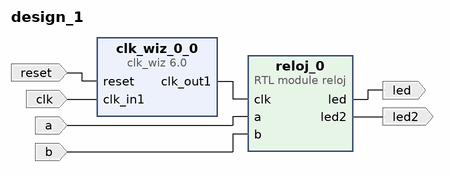
[diagram p0: block diagram of the top level]
# Vivado block design design_1, xc7a35tcpg236-1, Vivado 2018.3
create_bd_design design_1

create_bd_port -dir I -type rst reset
set_property -dict {CONFIG.POLARITY ACTIVE_HIGH} [get_bd_ports reset]
create_bd_port -dir I -type clk clk
create_bd_port -dir I a
create_bd_port -dir I b
create_bd_port -dir O led2
create_bd_port -dir O led

create_bd_cell -type ip -vlnv xilinx.com:ip:clk_wiz:6.0 clk_wiz_0_0
create_bd_cell -type module -reference reloj reloj_0

# ---- connections ----

connect_bd_net -net clk_wiz_0_clk_out1 [get_bd_pins clk_wiz_0_0/clk_out1] [get_bd_pins reloj_0/clk]
connect_bd_net -net reset_0_1 [get_bd_ports reset] [get_bd_pins clk_wiz_0_0/reset]
connect_bd_net -net clk_in1_0_1 [get_bd_ports clk] [get_bd_pins clk_wiz_0_0/clk_in1]
connect_bd_net -net a_0_1 [get_bd_ports a] [get_bd_pins reloj_0/a]
connect_bd_net -net b_0_1 [get_bd_ports b] [get_bd_pins reloj_0/b]
connect_bd_net [get_bd_pins reloj_0/led2] [get_bd_ports led2]
connect_bd_net [get_bd_pins reloj_0/led] [get_bd_ports led]

validate_bd_design
save_bd_design
